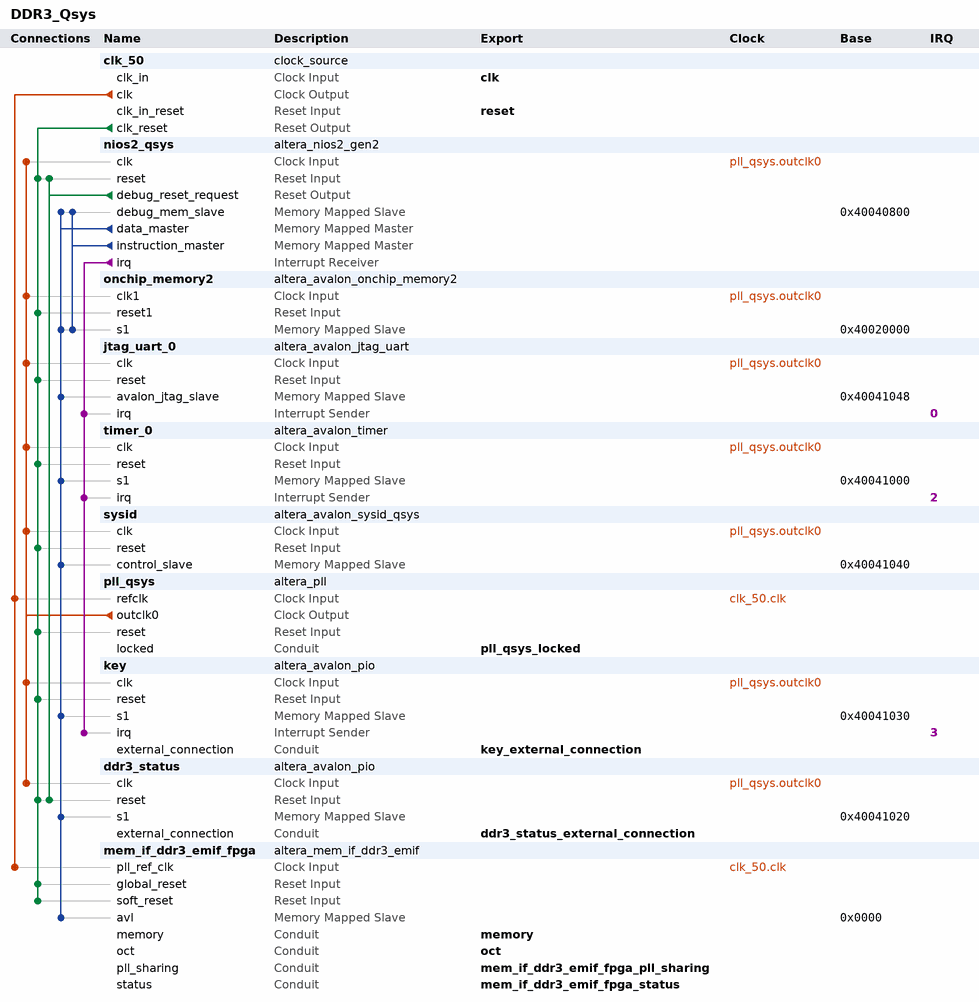
[diagram p0: system contents]
# Platform Designer (Qsys) system DDR3_Qsys, Cyclone V 5CSXFC6D6F31C6
# Parameters at their usual value, and those the tool derives, are not listed.
package require -exact qsys 17.1
create_system DDR3_Qsys
set_project_property DEVICE_FAMILY {Cyclone V}
set_project_property DEVICE 5CSXFC6D6F31C6

add_instance clk_50 clock_source 17.1
set_instance_parameter_value clk_50 clockFrequency 50000000

add_instance nios2_qsys altera_nios2_gen2 17.1
set_instance_parameter_value nios2_qsys dcache_size 2048
set_instance_parameter_value nios2_qsys exceptionSlave onchip_memory2.s1
set_instance_parameter_value nios2_qsys icache_size 4096
set_instance_parameter_value nios2_qsys impl Fast
set_instance_parameter_value nios2_qsys resetSlave onchip_memory2.s1
set_instance_parameter_value nios2_qsys setting_activateTrace true

add_instance onchip_memory2 altera_avalon_onchip_memory2 17.1
set_instance_parameter_value onchip_memory2 dataWidth 32
set_instance_parameter_value onchip_memory2 dualPort false
set_instance_parameter_value onchip_memory2 initMemContent true
set_instance_parameter_value onchip_memory2 initializationFileName onchip_memory2
set_instance_parameter_value onchip_memory2 memorySize 128000

add_instance jtag_uart_0 altera_avalon_jtag_uart 17.1
set_instance_parameter_value jtag_uart_0 simInteractiveOptions INTERACTIVE_ASCII_OUTPUT

add_instance timer_0 altera_avalon_timer 17.1
set_instance_parameter_value timer_0 period 1
set_instance_parameter_value timer_0 periodUnits MSEC

add_instance sysid altera_avalon_sysid_qsys 17.1
set_instance_parameter_value sysid id 0

add_instance pll_qsys altera_pll 17.1
set_instance_parameter_value pll_qsys gui_device_speed_grade 2
set_instance_parameter_value pll_qsys gui_number_of_clocks 1
set_instance_parameter_value pll_qsys gui_operation_mode normal
set_instance_parameter_value pll_qsys gui_output_clock_frequency0 100.0
set_instance_parameter_value pll_qsys gui_pll_mode {Integer-N PLL}
set_instance_parameter_value pll_qsys gui_reference_clock_frequency 50.0
set_instance_parameter_value pll_qsys gui_use_locked true

add_instance key altera_avalon_pio 17.1
set_instance_parameter_value key captureEdge true
set_instance_parameter_value key direction Input
set_instance_parameter_value key generateIRQ true
set_instance_parameter_value key irqType EDGE
set_instance_parameter_value key width 4

add_instance ddr3_status altera_avalon_pio 17.1
set_instance_parameter_value ddr3_status direction Input
set_instance_parameter_value ddr3_status width 3

add_instance mem_if_ddr3_emif_fpga altera_mem_if_ddr3_emif 17.1
set_instance_parameter_value mem_if_ddr3_emif_fpga AVL_MAX_SIZE 4
set_instance_parameter_value mem_if_ddr3_emif_fpga CALIBRATION_MODE Full
set_instance_parameter_value mem_if_ddr3_emif_fpga CPORT_TYPE_PORT Bidirectional,Bidirectional,Bidirectional,Bidirectional,Bidirectional,Bidirectional
set_instance_parameter_value mem_if_ddr3_emif_fpga EXPORT_AFI_HALF_CLK false
set_instance_parameter_value mem_if_ddr3_emif_fpga HARD_EMIF false
set_instance_parameter_value mem_if_ddr3_emif_fpga MEM_BANKADDR_WIDTH 3
set_instance_parameter_value mem_if_ddr3_emif_fpga MEM_CLK_FREQ 300.0
set_instance_parameter_value mem_if_ddr3_emif_fpga MEM_CLK_FREQ_MAX 400.0
set_instance_parameter_value mem_if_ddr3_emif_fpga MEM_COL_ADDR_WIDTH 10
set_instance_parameter_value mem_if_ddr3_emif_fpga MEM_DQ_WIDTH 32
set_instance_parameter_value mem_if_ddr3_emif_fpga MEM_FORMAT DISCRETE
set_instance_parameter_value mem_if_ddr3_emif_fpga MEM_ROW_ADDR_WIDTH 15
set_instance_parameter_value mem_if_ddr3_emif_fpga MEM_TCL 6
set_instance_parameter_value mem_if_ddr3_emif_fpga MEM_TFAW_NS 50.0
set_instance_parameter_value mem_if_ddr3_emif_fpga MEM_TRAS_NS 37.5
set_instance_parameter_value mem_if_ddr3_emif_fpga MEM_TRCD_NS 15.0
set_instance_parameter_value mem_if_ddr3_emif_fpga MEM_TRFC_NS 300.0
set_instance_parameter_value mem_if_ddr3_emif_fpga MEM_TRP_NS 15.0
set_instance_parameter_value mem_if_ddr3_emif_fpga MEM_TRRD_NS 13.2
set_instance_parameter_value mem_if_ddr3_emif_fpga MEM_TRTP_NS 13.2
set_instance_parameter_value mem_if_ddr3_emif_fpga MEM_TWTR 4
set_instance_parameter_value mem_if_ddr3_emif_fpga MEM_VENDOR JEDEC
set_instance_parameter_value mem_if_ddr3_emif_fpga MEM_WTCL 5
set_instance_parameter_value mem_if_ddr3_emif_fpga PLL_LOCATION Top_Bottom
set_instance_parameter_value mem_if_ddr3_emif_fpga POWER_OF_TWO_BUS false
set_instance_parameter_value mem_if_ddr3_emif_fpga PRIORITY_PORT 1,1,1,1,1,1
set_instance_parameter_value mem_if_ddr3_emif_fpga RATE Half
set_instance_parameter_value mem_if_ddr3_emif_fpga REF_CLK_FREQ 50.0
set_instance_parameter_value mem_if_ddr3_emif_fpga SPEED_GRADE 8
set_instance_parameter_value mem_if_ddr3_emif_fpga TIMING_BOARD_AC_SKEW 0.03
set_instance_parameter_value mem_if_ddr3_emif_fpga TIMING_BOARD_AC_TO_CK_SKEW 0.0
set_instance_parameter_value mem_if_ddr3_emif_fpga TIMING_BOARD_DQ_TO_DQS_SKEW 0.0
set_instance_parameter_value mem_if_ddr3_emif_fpga TIMING_BOARD_MAX_CK_DELAY 0.03
set_instance_parameter_value mem_if_ddr3_emif_fpga TIMING_BOARD_MAX_DQS_DELAY 0.03
set_instance_parameter_value mem_if_ddr3_emif_fpga TIMING_BOARD_SKEW_BETWEEN_DQS 0.08
set_instance_parameter_value mem_if_ddr3_emif_fpga TIMING_BOARD_SKEW_CKDQS_DIMM_MAX 0.0
set_instance_parameter_value mem_if_ddr3_emif_fpga TIMING_BOARD_SKEW_CKDQS_DIMM_MIN 0.0
set_instance_parameter_value mem_if_ddr3_emif_fpga TIMING_BOARD_SKEW_WITHIN_DQS 0.01
set_instance_parameter_value mem_if_ddr3_emif_fpga TIMING_TDH 150
set_instance_parameter_value mem_if_ddr3_emif_fpga TIMING_TDQSCK 400
set_instance_parameter_value mem_if_ddr3_emif_fpga TIMING_TDQSQ 200
set_instance_parameter_value mem_if_ddr3_emif_fpga TIMING_TDQSS 0.25
set_instance_parameter_value mem_if_ddr3_emif_fpga TIMING_TDS 75
set_instance_parameter_value mem_if_ddr3_emif_fpga TIMING_TDSH 0.2
set_instance_parameter_value mem_if_ddr3_emif_fpga TIMING_TDSS 0.2
set_instance_parameter_value mem_if_ddr3_emif_fpga TIMING_TIH 275
set_instance_parameter_value mem_if_ddr3_emif_fpga TIMING_TIS 200
set_instance_parameter_value mem_if_ddr3_emif_fpga TIMING_TQSH 0.38
set_instance_parameter_value mem_if_ddr3_emif_fpga USER_DEBUG_LEVEL 1

# connections
add_connection clk_50.clk mem_if_ddr3_emif_fpga.pll_ref_clk clock
add_connection clk_50.clk pll_qsys.refclk clock
add_connection pll_qsys.outclk0 ddr3_status.clk clock
add_connection pll_qsys.outclk0 jtag_uart_0.clk clock
add_connection pll_qsys.outclk0 key.clk clock
add_connection pll_qsys.outclk0 nios2_qsys.clk clock
add_connection pll_qsys.outclk0 onchip_memory2.clk1 clock
add_connection pll_qsys.outclk0 sysid.clk clock
add_connection pll_qsys.outclk0 timer_0.clk clock
add_connection clk_50.clk_reset ddr3_status.reset reset
add_connection clk_50.clk_reset jtag_uart_0.reset reset
add_connection clk_50.clk_reset key.reset reset
add_connection clk_50.clk_reset mem_if_ddr3_emif_fpga.global_reset reset
add_connection clk_50.clk_reset mem_if_ddr3_emif_fpga.soft_reset reset
add_connection clk_50.clk_reset nios2_qsys.reset reset
add_connection clk_50.clk_reset onchip_memory2.reset1 reset
add_connection clk_50.clk_reset pll_qsys.reset reset
add_connection clk_50.clk_reset sysid.reset reset
add_connection clk_50.clk_reset timer_0.reset reset
add_connection nios2_qsys.debug_reset_request ddr3_status.reset reset
add_connection nios2_qsys.debug_reset_request nios2_qsys.reset reset
add_connection nios2_qsys.data_master ddr3_status.s1 avalon
set_connection_parameter_value nios2_qsys.data_master/ddr3_status.s1 baseAddress 0x40041020
add_connection nios2_qsys.data_master jtag_uart_0.avalon_jtag_slave avalon
set_connection_parameter_value nios2_qsys.data_master/jtag_uart_0.avalon_jtag_slave baseAddress 0x40041048
add_connection nios2_qsys.data_master key.s1 avalon
set_connection_parameter_value nios2_qsys.data_master/key.s1 baseAddress 0x40041030
add_connection nios2_qsys.data_master mem_if_ddr3_emif_fpga.avl avalon
set_connection_parameter_value nios2_qsys.data_master/mem_if_ddr3_emif_fpga.avl baseAddress 0x0000
add_connection nios2_qsys.data_master nios2_qsys.debug_mem_slave avalon
set_connection_parameter_value nios2_qsys.data_master/nios2_qsys.debug_mem_slave baseAddress 0x40040800
add_connection nios2_qsys.data_master onchip_memory2.s1 avalon
set_connection_parameter_value nios2_qsys.data_master/onchip_memory2.s1 baseAddress 0x40020000
add_connection nios2_qsys.data_master sysid.control_slave avalon
set_connection_parameter_value nios2_qsys.data_master/sysid.control_slave baseAddress 0x40041040
add_connection nios2_qsys.data_master timer_0.s1 avalon
set_connection_parameter_value nios2_qsys.data_master/timer_0.s1 baseAddress 0x40041000
add_connection nios2_qsys.instruction_master nios2_qsys.debug_mem_slave avalon
set_connection_parameter_value nios2_qsys.instruction_master/nios2_qsys.debug_mem_slave baseAddress 0x40040800
add_connection nios2_qsys.instruction_master onchip_memory2.s1 avalon
set_connection_parameter_value nios2_qsys.instruction_master/onchip_memory2.s1 baseAddress 0x40020000
add_connection nios2_qsys.irq jtag_uart_0.irq interrupt
set_connection_parameter_value nios2_qsys.irq/jtag_uart_0.irq irqNumber 0
add_connection nios2_qsys.irq key.irq interrupt
set_connection_parameter_value nios2_qsys.irq/key.irq irqNumber 3
add_connection nios2_qsys.irq timer_0.irq interrupt
set_connection_parameter_value nios2_qsys.irq/timer_0.irq irqNumber 2

# exported interfaces
add_interface clk clock sink
set_interface_property clk EXPORT_OF clk_50.clk_in
add_interface ddr3_status_external_connection conduit end
set_interface_property ddr3_status_external_connection EXPORT_OF ddr3_status.external_connection
add_interface key_external_connection conduit end
set_interface_property key_external_connection EXPORT_OF key.external_connection
add_interface mem_if_ddr3_emif_fpga_pll_sharing conduit end
set_interface_property mem_if_ddr3_emif_fpga_pll_sharing EXPORT_OF mem_if_ddr3_emif_fpga.pll_sharing
add_interface mem_if_ddr3_emif_fpga_status conduit end
set_interface_property mem_if_ddr3_emif_fpga_status EXPORT_OF mem_if_ddr3_emif_fpga.status
add_interface memory conduit end
set_interface_property memory EXPORT_OF mem_if_ddr3_emif_fpga.memory
add_interface oct conduit end
set_interface_property oct EXPORT_OF mem_if_ddr3_emif_fpga.oct
add_interface pll_qsys_locked conduit end
set_interface_property pll_qsys_locked EXPORT_OF pll_qsys.locked
add_interface reset reset sink
set_interface_property reset EXPORT_OF clk_50.clk_in_reset

set_interconnect_requirement {$system} qsys_mm.clockCrossingAdapter HANDSHAKE
set_interconnect_requirement {$system} qsys_mm.maxAdditionalLatency 1

save_system DDR3_Qsys.qsys
